# Altium schematic sheet Cover.SchDoc
size B
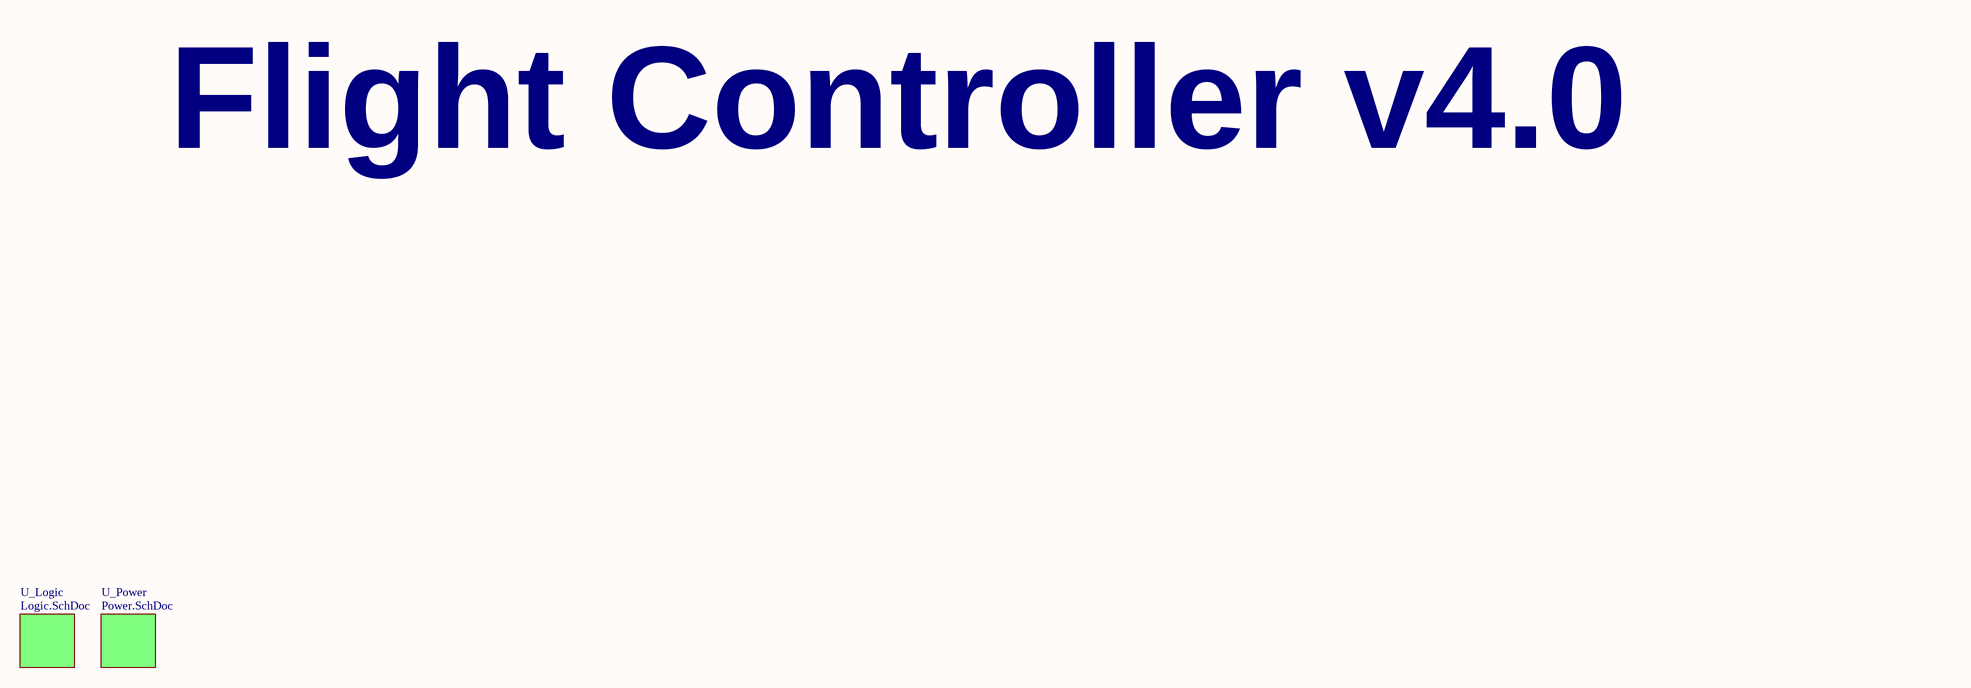
[diagram p0: Cover.SchDoc]

## Sub-sheets
U_Logic = Logic.SchDoc: no entries
U_Power = Power.SchDoc: no entries

## Notes on the sheet
- Flight Controller v4.0